# Altium project 发光陀螺.PrjPcb
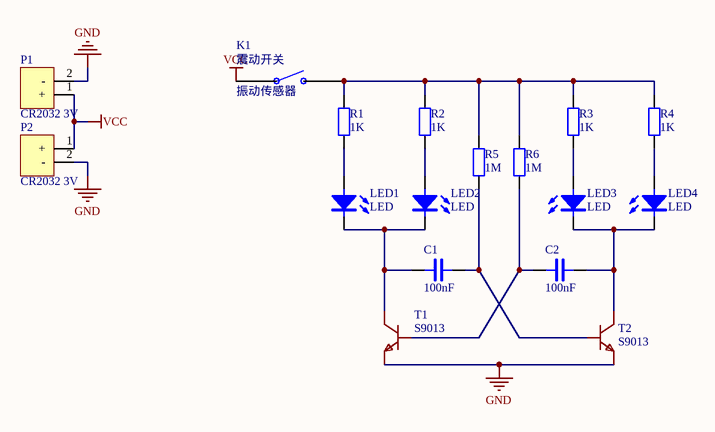
[diagram p0: 发光陀螺.SchDoc]
1 sheet, 17 parts. Net scope: global (net labels, ports and power ports of the same name join across sheets).
Board file: 发光陀螺.PcbDoc

## Sheet 发光陀螺.SchDoc
size A4; SheetNumber: 1; SheetTotal: 1

### Parts
C1  100nF  [0603_C]
C2  100nF  [0603_C]
K1  振动传感器  [SW-28020]
LED1  LED  [LED 2.54mm 直插式 5mm]
LED2  LED  [LED 2.54mm 直插式 5mm]
LED3  LED  [LED 2.54mm 直插式 5mm]
LED4  LED  [LED 2.54mm 直插式 5mm]
P1  CR2032 3V  [CR2032_电池座]
P2  CR2032 3V  [CR2032_电池座]
R1  1K  [0603_R]
R2  1K  [0603_R]
R3  1K  [0603_R]
R4  1K  [0603_R]
R5  1M  [0603_R]
R6  1M  [0603_R]
T1  S9013  [SOT-23-3]
T2  S9013  [SOT-23-3]

### Nets
GND: P1.2(-) P2.2(-) T1.2(E) T2.2(E)
VCC: K1.1 P1.1(+) P2.1(+)
NetC1_1: C1.1 LED1.2(C) LED2.2(C) T1.3(C)
NetC1_2: C1.2 R5.1 T2.1(B)
NetC2_1: C2.1 LED3.2(C) LED4.2(C) T2.3(C)
NetC2_2: C2.2 R6.1 T1.1(B)
NetK1_2: K1.2 R1.2 R2.2 R3.2 R4.2 R5.2 R6.2
NetLED1_1: LED1.1(A) R1.1
NetLED2_1: LED2.1(A) R2.1
NetLED3_1: LED3.1(A) R3.1
NetLED4_1: LED4.1(A) R4.1

### Notes on the sheet
- (in symbol 振动传感器) 震动开关

### Library data of the parts
C1 C2 = CAP: Capacitor
K1 = 振动传感器: Key,振荡传感器
P1 P2 = 纽扣电池电池座: 电源接口
R1-R6 = RES: Resistor
T1 T2 = S9013: NPN